# Altium project EN1093.PrjPcb
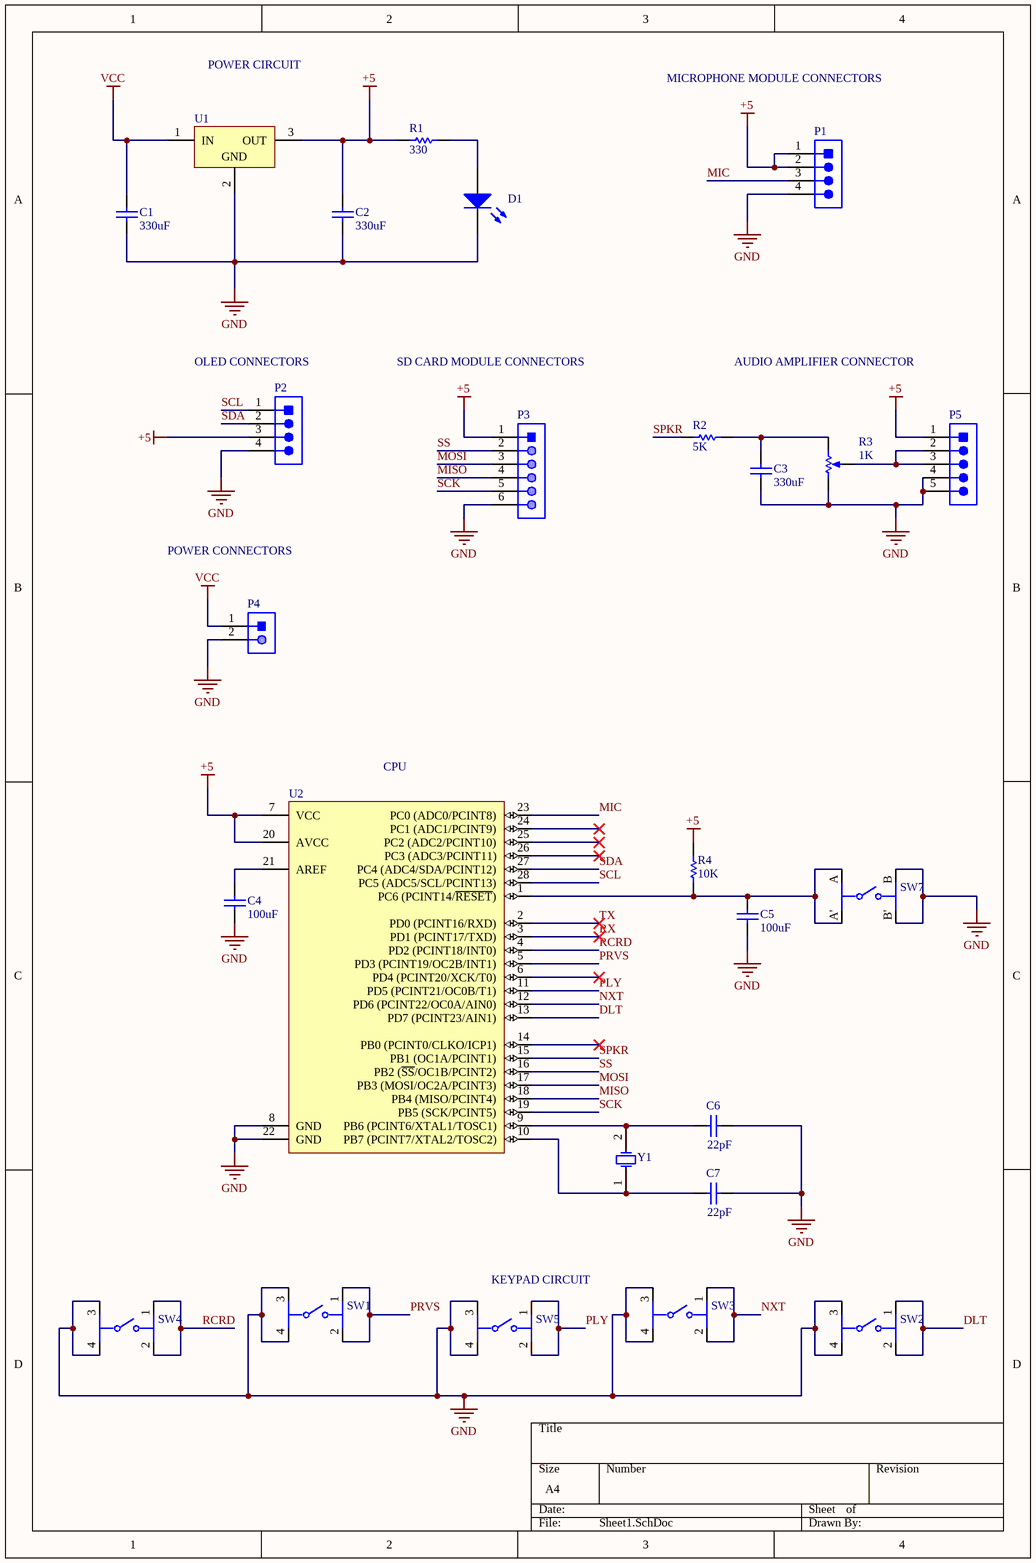
[diagram p0: Sheet1.SchDoc]
1 sheet, 26 parts. Net scope: global (net labels, ports and power ports of the same name join across sheets).
Board file: PCB_EN1093.PcbDoc

## Sheet Sheet1.SchDoc
size A4 portrait; SheetNumber: 1; SheetTotal: 1

### Parts
C1  330uF  [RAD-0.3]
C2  330uF  [RAD-0.3]
C3  330uF  [RAD-0.3]
C4  Capacitance: 100uF  [KEMT-C330C105M5U5TA]
C5  Capacitance: 100uF  [KEMT-C330C105M5U5TA]  (hidden comment: C330C105M5U5TA)
C6  Capacitance: 22pF  [KEMT-C330C105M5U5TA]  (hidden comment: C330C105M5U5TA)
C7  Capacitance: 22pF  [KEMT-C330C105M5U5TA]  (hidden comment: C330C105M5U5TA)
D1  LED1  [LED-1]  (value not drawn)
P1  640456-4  [TECO-640456-4]  (value not drawn)
P2  640456-4  [TECO-640456-4]  (value not drawn)
P3  66200611122  [66200611122]  (value not drawn)
P4  61900211121  [61900211121]  (value not drawn)
P5  640456-5  [TECO-640456-5]  (value not drawn)
R1  330  [AXIAL-0.3]
R2  5K  [AXIAL-0.3]
R3  1K  [VR5]
R4  10K  [AXIAL-0.3]
SW1  FSM100  [FP-FSM100-MFG]  (value not drawn)
SW2  FSM100  [FP-FSM100-MFG]  (value not drawn)
SW3  FSM100  [FP-FSM100-MFG]  (value not drawn)
SW4  FSM100  [FP-FSM100-MFG]  (value not drawn)
SW5  FSM100  [FP-FSM100-MFG]  (value not drawn)
SW7  EVQ-PAG07K  [FP-EVQ-PAG07K-MFG]  (value not drawn)
U1  L7805CV  [TO220]  (value not drawn)
U2  ATmega328P-PU  [28P3]  (value not drawn)
Y1  XTAL  [R38]  (value not drawn)

### Nets
+5: C2.2 P1.1 P1.2 P2.3 P3.1 P5.1(DTR) R1.1 R4.1 U1.3(OUT) U2.7(VCC) U2.20(AVCC)
GND: C1.1 C2.1 C3.1 C4.1 C5.1 C6.2 C7.2 D1.2(K) P1.4 P2.4 P3.6 P4.2 P5.4(VCC) P5.5(CTS) R3.1(TOP) SW1.3 SW1.4 SW2.3 SW2.4 SW3.3 SW3.4 SW4.3 SW4.4 SW5.3 SW5.4 SW7.B SW7.B' U1.2(GND) U2.8(GND) U2.22(GND)
VCC: C1.2 P4.1 U1.1(IN)
DLT: SW2.1 SW2.2 U2.13(PD7_(PCINT23/AIN1))
MIC: P1.3 U2.23(PC0_(ADC0/PCINT8))
MISO: P3.4 U2.18(PB4_(MISO/PCINT4))
MOSI: P3.3 U2.17(PB3_(MOSI/OC2A/PCINT3))
NXT: SW3.1 SW3.2 U2.12(PD6_(PCINT22/OC0A/AIN0))
PLY: SW5.1 SW5.2 U2.11(PD5_(PCINT21/OC0B/T1))
PRVS: SW1.1 SW1.2 U2.5(PD3_(PCINT19/OC2B/INT1))
RCRD: SW4.1 SW4.2 U2.4(PD2_(PCINT18/INT0))
RX: U2.3(PD1_(PCINT17/TXD))
SCK: P3.5 U2.19(PB5_(SCK/PCINT5))
SCL: P2.1 U2.28(PC5_(ADC5/SCL/PCINT13))
SDA: P2.2 U2.27(PC4_(ADC4/SDA/PCINT12))
SPKR: R2.2 U2.15(PB1_(OC1A/PCINT1))
SS: P3.2 U2.16(PB2_(~{SS}/OC1B/PCINT2))
TX: U2.2(PD0_(PCINT16/RXD))
NetC3_2: C3.2 R2.1 R3.2(BOT)
NetC4_2: C4.2 U2.21(AREF)
NetC5_2: C5.2 R4.2 SW7.A SW7.A' U2.1(PC6_(PCINT14/~{RESET}))
NetC6_1: C6.1 U2.9(PB6_(PCINT6/XTAL1/TOSC1)) Y1.2(OSC2)
NetC7_1: C7.1 U2.10(PB7_(PCINT7/XTAL2/TOSC2)) Y1.1(OSC1)
NetD1_1: D1.1(A) R1.2
NetP5_2: P5.2(RXI) P5.3(TXO) R3.3(TAP)

Not connected (* = marked no-connect by the designer): U2 6(PD4_(PCINT20/XCK/T0))* 14(PB0_(PCINT0/CLKO/ICP1))* 24(PC1_(ADC1/PCINT9))* 25(PC2_(ADC2/PCINT10))* 26(PC3_(ADC3/PCINT11))*

### Notes on the sheet
- POWER CIRCUIT
- MICROPHONE MODULE CONNECTORS
- (near P2) OLED CONNECTORS
- SD CARD MODULE CONNECTORS
- AUDIO AMPLIFIER CONNECTOR
- POWER CONNECTORS
- (near U2) CPU
- (near SW5) KEYPAD CIRCUIT

### Library data of the parts
C1-C3 = Cap: Capacitor; Published: 8-Jun-2000; LatestRevisionDate: 17-Jul-2002; LatestRevisionNote: Re-released for DXP Platform.; PackageReference: RAD-0.3; Publisher: Altium Limited; PackageDescription: Radial Cap, Thru-Hole; 2 Leads; 0.3 in Pin Spacing; Value: 330uF
C4-C7 = CMP-2000-06056-1: Ceramic Capacitor, 1 uF, +/- 20%, 50 V, -10 to 85 degC, 2-Pin THD, RoHS, Bulk; Manufacturer: Kemet; Voltage - Rated: 50V; Temperature Coefficient: Z5U; Catalog Drawings: C330(std); Product Training Modules: CapacitorBasics-TypicalUsesforCapacitors; Online Catalog: GoldenMax™Series; Other Names: 399-4390; PCN Design/Specification: C3yySeriesGoldenMaxLeadConfiguration02/Feb/2015; Thickness (Max): -; Size / Dimension: 0.300"Lx0.150"W(7.62mmx3.81mm); Mounting Technology: ThroughHole; Tolerance: ±20%; Mounting Type: ThroughHole; Datasheet URL: http://www.kemet.com/Lists/ProductCatalog/Attachments/599/KEM_C1051_GOLDMAX_Z5U.pdf; Series: GoldenMax™; Standard Package: 250; Ratings: -; Applications: GeneralPurpose; Package Reference: C330C105M5U5TA; Packaging: Bulk; Category: Capacitors; Package Description: 2-Pin Through Hole Device, Body 7.11 x 4.07 mm; Operating Temperature: 10°C~85°C; Height - Seated (Max): 0.360"(9.14mm); Manufacturer URL: http://www.kemet.com/; Lead Spacing: 0.200"(5.08mm); Features: -; Lead Style: Straight; Package / Case: Radial; Family: CeramicCapacitors; Datasheet Version: 12/2015
D1 = LED1: Typical RED GaAs LED; Published: 8-Jun-2000; LatestRevisionDate: 08-Jul-2005; LatestRevisionNote: Mech Layer 1 removed.; PackageReference: LED-1; Publisher: Altium Limited; PackageDescription: LED; 2 Leads
P1 P2 = CMP-2000-05419-1: Male Header, Pitch 2.54 mm, 1 x 4 Position, Height 10.03 mm, Tail Length 3.56 mm, RoHS, Bulk; Manufacturer: TE Connectivity; Material, Housing: Polyester; Primary Type: InterconnectSystem; Mount Angle: Vertical; Color, Housing: White; Current, Rating: 5 / A; Agency Approvals: CSA,UL; Contact Termination Area Plating: Tin; Temperature, Operating: -55to+105 / degC; Standards: RoHSCompliant,ELVCompliant,UL94V-0; Number of Positions: 4; Brand/Series: MTA-100Series; Angle: Straight; Pin Spacing: 0.1 / "; Material, Contact: CopperAlloy; Connector Type: MTA-100; Special Features: Pinstrip; Mounting Hole Size: 0.04 / "; Contact Centerline Spacing: 0.100 / in.; Voltage, Rating: 250 / V; Manufacturer URL: http://www.te.com/; Length, Pin: 0.14 / "; Length, Overall: 0.4 / "; Color: White; Flammability Rating: UL94V-0; Mounting Type: PCMount; Termination: Solder; Datasheet URL: https://datasheet.ciiva.com/16286/eng-ds-82056-mta-0608-16286228.pdf; Number of Contacts: 4; Contact Shape: Square; Contact Mating Area Plating: Tin; Length, Terminal Post: 0.14 / in.; Size, Post: 0.025 / in.; Contact Plating: Tin; Type: PCBPlug; Datasheet Version: Dec-14; Number of Rows: 1
P3 = CMP-1502-00444-1: THT Male Header WR-MPC3, Vertical, Single Row, pitch 3 mm, 6 pins; Manufacturer: Wurth Elektronik; Working Voltage: 250VAC; Contact Resistance: 10mOhm; Pin Number: 6; Pitch: 3mm; Package Reference: 66200611122; Manufacturer URL: http://www.we-online.de; Packaging: Tube; Operating Temperature: -40to105degC; Publisher: WurthElektronik; Datasheet URL: https://katalog.we-online.de/em/datasheet/6620xx11122.pdf; Mounting Technology: THT; Gender: Male; Part Number: 66200611122; Orientation: Vertical
P4 = CMP-1502-00584-1: Male Locking Header WR-WTB, THT, Vertical, pitch 2.54 mm, 1 x 2 position; Manufacturer: Wurth Elektronik; Position: 1x2; Contact Resistance: 20mOhm; Working Voltage: 250VAC; Pitch: 2.54mm; Gender: Male; Part Number: 61900211121; Mounting Technology: THT; Operating Temperature: -40to105degC; Orientation: Vertical; Packaging: Bag; Package Reference: 61900211121; Manufacturer URL: http://www.we-online.de; Datasheet URL: https://katalog.we-online.de/em/datasheet/6190xx11121.pdf; Publisher: WurthElektronik
P5 = CMP-1684-00014-1: Male Header, Pitch 2.54 mm, 1 x 5 Position, Height 10.03 mm, Tail Length 3.56 mm, / -55 to 105 degC, RoHS, Bulk; Manufacturer: TE Connectivity; Material, Housing: Polyester; Brand/Series: MTA-100Series; Color, Housing: White; Current, Rating: 5 / A; Temperature, Operating: -55to+105 / °C; Connector Type: MTA-100; Agency Approvals: CSA,UL; Material, Contact: CopperAlloy; Mounting Hole Size: 0.04 / "; Voltage, Rating: 250 / V; Contact Termination Area Plating: Tin; Pin Spacing: 0.1 / "; Primary Type: InterconnectSystem; Special Features: Pinstrip; Mount Angle: Vertical; Contact Centerline Spacing: 0.100 / in.; Number of Contacts: 5; Standards: RoHSCompliant,ELVCompliant,UL94V-0; Angle: Straight; Length, Terminal Post: 0.14 / in.; Manufacturer URL: http://www.te.com; Flammability Rating: UL94V-0; Mounting Type: PCMount; Termination: Solder; Package Reference: THD; Length, Overall: 0.5 / "; Contact Mating Area Plating: Tin; Length, Pin: 0.14 / "; Datasheet URL: http://sigma.octopart.com/77881742/technical_drawing/TE-Connectivity-640456-5.pdf; Package Description: Male Header, Pitch 2.54 mm, 1 x 5 Position, Height 10.03 mm, Tail Length 3.56 mm; Datasheet Version: Rev. W3; Contact Plating: Tin; Color: White; Number of Positions: 5; Type: PCBPlug; Contact Shape: Square; Number of Rows: 1; Size, Post: 0.025 / in.
R1 R2 R4 = Res1: Resistor; Published: 8-Jun-2000; LatestRevisionDate: 17-Jul-2002; LatestRevisionNote: Re-released for DXP Platform.; PackageReference: AXIAL-0.3; Publisher: Altium Limited; PackageDescription: Axial Device, Thru-Hole; 2 Leads; 0.3 in Pin Spacing
  R1: Value: 330
  R2: Value: 5K
  R4: Value: 10K
R3 = RPot: Potentiometer; Sim Note: Enter the Resistance value and the set point into parameter fields.; Set Position: 0.5; Published: 8-Jun-2000; LatestRevisionDate: 17-Jul-2002; LatestRevisionNote: Re-released for DXP Platform.; PackageReference: VR5; Publisher: Altium Limited; PackageDescription: Variable Resistor, Thru-Hole; 3 Leads; Value: 1K
SW1-SW5 = CMP-03402-000014-1: SWITCH TACTILE SPST-NO 0.05A 24V; Throw Configuration: SPST; Max Current Rating: 50mA; Switch Function: Off-Mom; Actuator Length: 6.35mm; Electrical Life: 100000Cycles; Max Voltage Rating (DC): 12V; Switch Travel: 0.3mm; Illumination Type: Non-Illuminated; Actuator Material: Polyester; Actuator Type: Standard; Actuator Color: Black; Contact Resistance: 100mR; Operating Force: 1.57N; Orientation: Straight; Contact Type: 1 maker; Current Rating: 50mA; Termination: PC Pins; Contact Current Rating: 50mA; Max Operating Temperature: 85°C; RoHS Compliant: Yes; Min Operating Temperature: -35°C; Contact Plating: Silver; Length: 12mm; Voltage Rating (DC): 24V; Type: Switch; Packaging: Loose Piece; Series: FSM100 ~ 104; Contact Material: Copper Alloy; Depth: 12.5mm; Lead Free: Lead Free; Mount: Through Hole; ELV: Compliant; Package Quantity: 400; Mechanical Life: 100000Cycles
SW7 = CMP-05618-000034-1: SWITCH TACTILE SPST-NO 0.02A 15V; Contact Current Rating: 20mA; Switch Function: Off-Mom; Illumination Type: Non-Illuminated; Switch Travel: 0.25mm; Operating Force: 2.6N; Actuator Color: Black; Actuator Length: 3.1mm; Contact Resistance: 50mR; Throw Configuration: SPST; Electrical Life: 50000Cycles; Actuator Type: Standard; Mount: Through Hole; Package Quantity: 500; RoHS Compliant: Yes; Packaging: Bulk; Orientation: Straight; Current Rating: 20mA; Voltage Rating (DC): 15V; Series: EVQPA; Length: 6mm; Termination: PC Pin; Max Current Rating: 20mA; Min Operating Temperature: -20°C; Size: 6mm; Depth: 7.8mm; Max Operating Temperature: 70°C; Mechanical Life: 50000Cycles; Lead Free: Lead Free; Max Voltage Rating (DC): 15V; Radiation Hardening: No
U1 = CMP-0244-00483-1: Positive Voltage Regulator, 5V, 3-Pin TO-220; PackageDescription: TO, Thru-Hole, Vertical, Heatsink Mounted; 3 In-Line Leads; Pitch 2.54 mm; ComponentLink2Description: Datasheet; PackageReference: TO220; ComponentLink3URL: http://www.st.com/internet/com/TECHNICAL_RESOURCES/TECHNICAL_LITERATURE/PACKAGE_INFORMATION/CD00004649.pdf; DatasheetVersion: 16/11/2011; ComponentLink1Description: Manufacturer URL; ComponentLink1URL: http://www.st.com; PackageVersion: ver3.0; ComponentLink3Description: Package Specification; ComponentLink2URL: http://www.st.com/internet/com/TECHNICAL_RESOURCES/TECHNICAL_LITERATURE/DATASHEET/CD00000444.pdf
U2 = CMP-0095-00013-2: 8-bit AVR Microcontroller, 32KB Flash, 1KB EEPROM, 2KB SRAM, 28-pin PDIP, Industrial Grade (-40°C to 85°C); RevisionNote: DatasheetVersion updated. URLs added.; PackageVersion: revB, Sep-2001; PackageDescription: 28-lead (0.300"/7.62mm Wide) Plastic Dual Inline Package (PDIP); DatasheetVersion: revD, May-2011; ComponentLink1Description: Manufacturer URL; ComponentLink1URL: http://www.atmel.com/; PackageReference: 28P3; ComponentLink2Description: ATmega48A/48PA/88A/88PA/168A/168PA/328/328P Datasheet; ComponentLink3URL: http://www.atmel.com/dyn/resources/prod_documents/8271S.pdf; ComponentLink2URL: http://www.atmel.com/dyn/resources/prod_documents/8271.pdf; ComponentLink3Description: ATmega48A/48PA/88A/88PA/168A/168PA/328/328P Summary
Y1 = XTAL: Crystal Oscillator; Published: 8-Jun-2000; LatestRevisionDate: 17-Jul-2002; LatestRevisionNote: Re-released for DXP Platform.; PackageReference: R38; Publisher: Altium Limited; PackageDescription: Crystal, Thru-Hole; 2 Leads; Body 3.1 x 8.2 mm (Dia.xH)